# EAGLE design kemu10 (EAGLE 5.08)
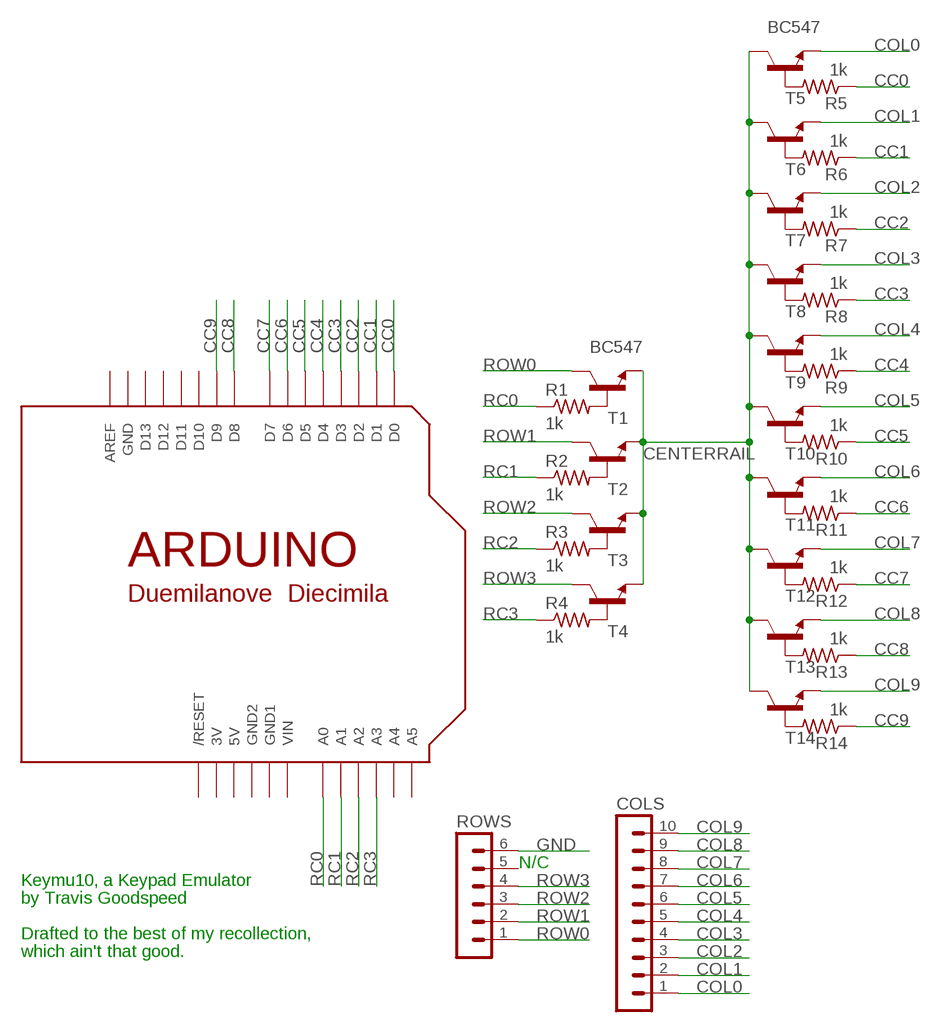
[diagram p0: schematic, sheet 1]

## Parts
COLS  MA10-1  [MA10-1]
R1  1k  FLIPFLOP-RES  [0805-THM]
R2  1k  FLIPFLOP-RES  [0805-THM]
R3  1k  FLIPFLOP-RES  [0805-THM]
R4  1k  FLIPFLOP-RES  [0805-THM]
R5  1k  FLIPFLOP-RES  [0805-THM]
R6  1k  FLIPFLOP-RES  [0805-THM]
R7  1k  FLIPFLOP-RES  [0805-THM]
R8  1k  FLIPFLOP-RES  [0805-THM]
R9  1k  FLIPFLOP-RES  [0805-THM]
R10  1k  FLIPFLOP-RES  [0805-THM]
R11  1k  FLIPFLOP-RES  [0805-THM]
R12  1k  FLIPFLOP-RES  [0805-THM]
R13  1k  FLIPFLOP-RES  [0805-THM]
R14  1k  FLIPFLOP-RES  [0805-THM]
ROWS  MA06-1  [MA06-1]
T1  BC547  [TO92]
T2  BC547  [TO92]
T3  BC547  [TO92]
T4  BC547  [TO92]
T5  BC547  [TO92]
T6  BC547  [TO92]
T7  BC547  [TO92]
T8  BC547  [TO92]
T9  BC547  [TO92]
T10  BC547  [TO92]
T11  BC547  [TO92]
T12  BC547  [TO92]
T13  BC547  [TO92]
T14  BC547  [TO92]
U$1  ARDUINODUEMILANOVE  [ARDUINO]

## Nets
CC0: R5.1 U$1.D0
CC1: R6.1 U$1.D1
CC2: R7.1 U$1.D2
CC3: R8.1 U$1.D3
CC4: R9.1 U$1.D4
CC5: R10.1 U$1.D5
CC6: R11.1 U$1.D6
CC7: R12.1 U$1.D7
CC8: R13.1 U$1.D8
CC9: R14.1 U$1.D9
CENTERRAIL: T1.1(E) T2.1(E) T3.1(E) T4.1(E) T5.3(C) T6.3(C) T7.3(C) T8.3(C) T9.3(C) T10.3(C) T11.3(C) T12.3(C) T13.3(C) T14.3(C)
COL0: COLS.1 T5.1(E)
COL1: COLS.2 T6.1(E)
COL2: COLS.3 T7.1(E)
COL3: COLS.4 T8.1(E)
COL4: COLS.5 T9.1(E)
COL5: COLS.6 T10.1(E)
COL6: COLS.7 T11.1(E)
COL7: COLS.8 T12.1(E)
COL8: COLS.9 T13.1(E)
COL9: COLS.10 T14.1(E)
GND: ROWS.6
N$1: R1.2 T1.2(B)
N$2: R2.2 T2.2(B)
N$3: R3.2 T3.2(B)
N$4: R4.2 T4.2(B)
N$6: R5.2 T5.2(B)
N$7: R6.2 T6.2(B)
N$8: R7.2 T7.2(B)
N$9: R8.2 T8.2(B)
N$10: R9.2 T9.2(B)
N$11: R10.2 T10.2(B)
N$12: R11.2 T11.2(B)
N$13: R12.2 T12.2(B)
N$14: R13.2 T13.2(B)
N$15: R14.2 T14.2(B)
RC0: R1.1 U$1.A0
RC1: R2.1 U$1.A1
RC2: R3.1 U$1.A2
RC3: R4.1 U$1.A3
ROW0: ROWS.1 T1.3(C)
ROW1: ROWS.2 T2.3(C)
ROW2: ROWS.3 T3.3(C)
ROW3: ROWS.4 T4.3(C)
Unconnected: ROWS.5 U$1.A4 U$1.A5 U$1.AREF U$1.D10 U$1.D11 U$1.D12 U$1.D13 U$1.RESET(/RESET)

## Notes on the sheet
- N/C
- Keymu10, a Keypad Emulator
- by Travis Goodspeed
- Drafted to the best of my recollection,
- which ain't that good.

## Power pins joined to a net without a drawn wire
3V: U$1.3V
5V: U$1.5V
GND: U$1.GND
GND1: U$1.GND1
GND2: U$1.GND2
VIN: U$1.VIN

## Library data of the parts
COLS = con-lstb:MA10-1: PIN HEADER
R1-R14 = adafruit:FLIPFLOP-RES: Flip Flop resistor An 0805 resistor inside a standard 1/4W 5% resistor. Makes for easy mods
ROWS = con-lstb:MA06-1: PIN HEADER
T1-T14 = transistor:BC547: NPN TRANSISTOR
U$1 = adafruit:ARDUINO: Arduino Diecimila/Duemilanove Make a shield with ease, this package has all the named pins as well as the two mounting drill holes and an outline of the USB and DC power connector. The outline is on the DIMENSION layer, so if your board house uses it they will cut the outline to match. http://www.ladyada.net/library/pcb/eaglelibrary.html

## Board
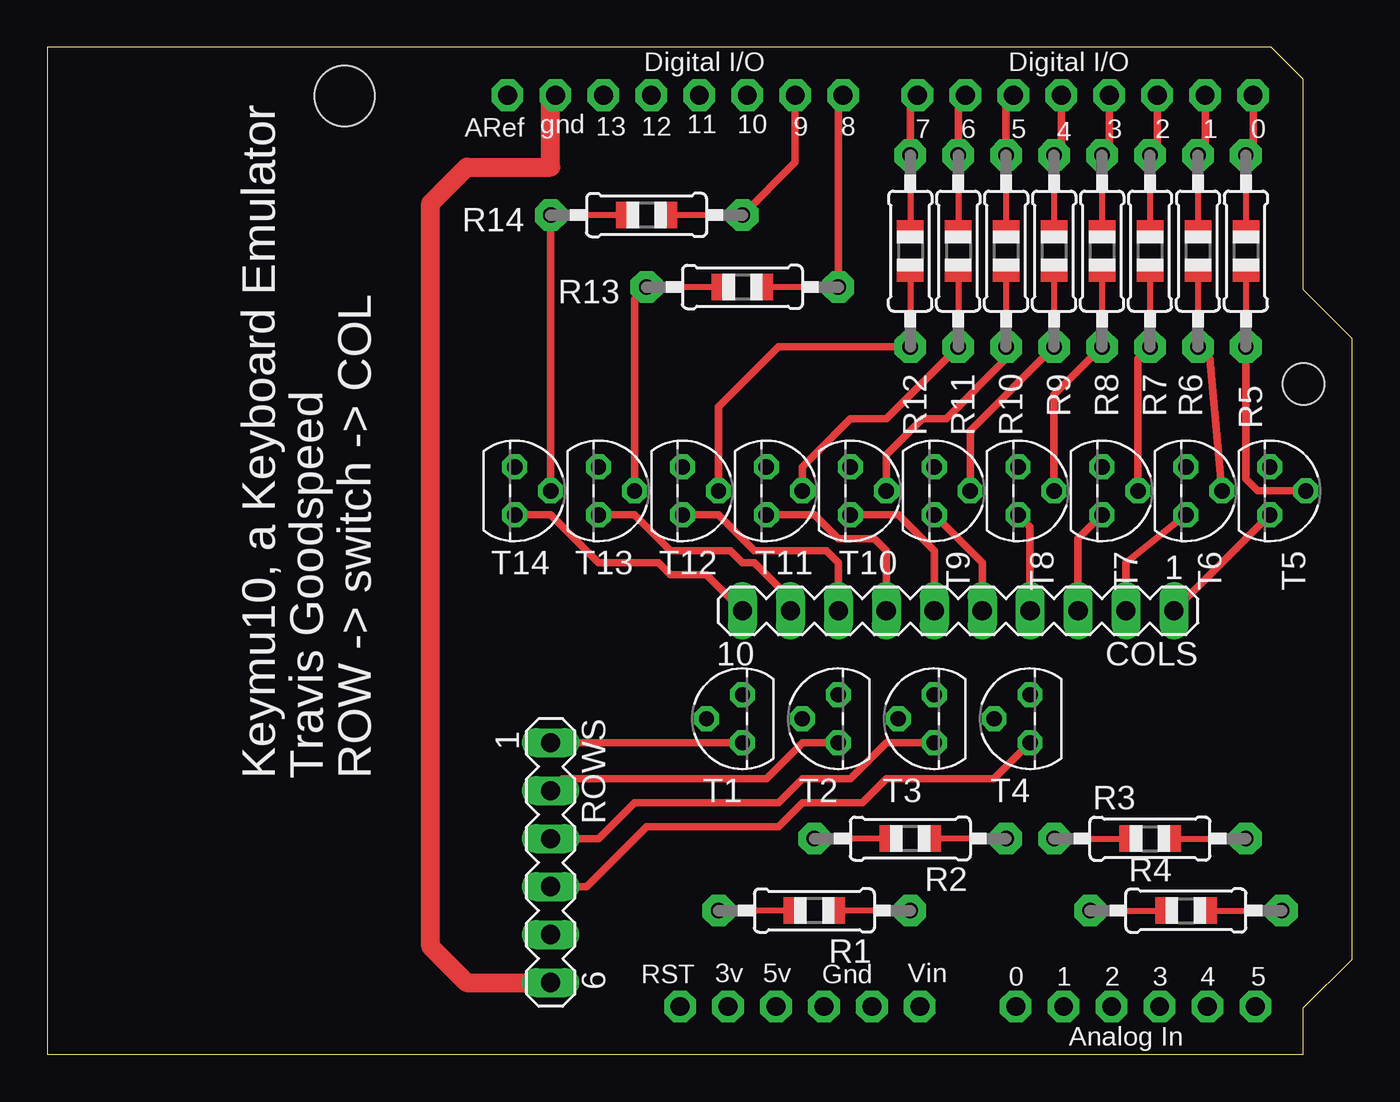
[diagram p1: board, top side]
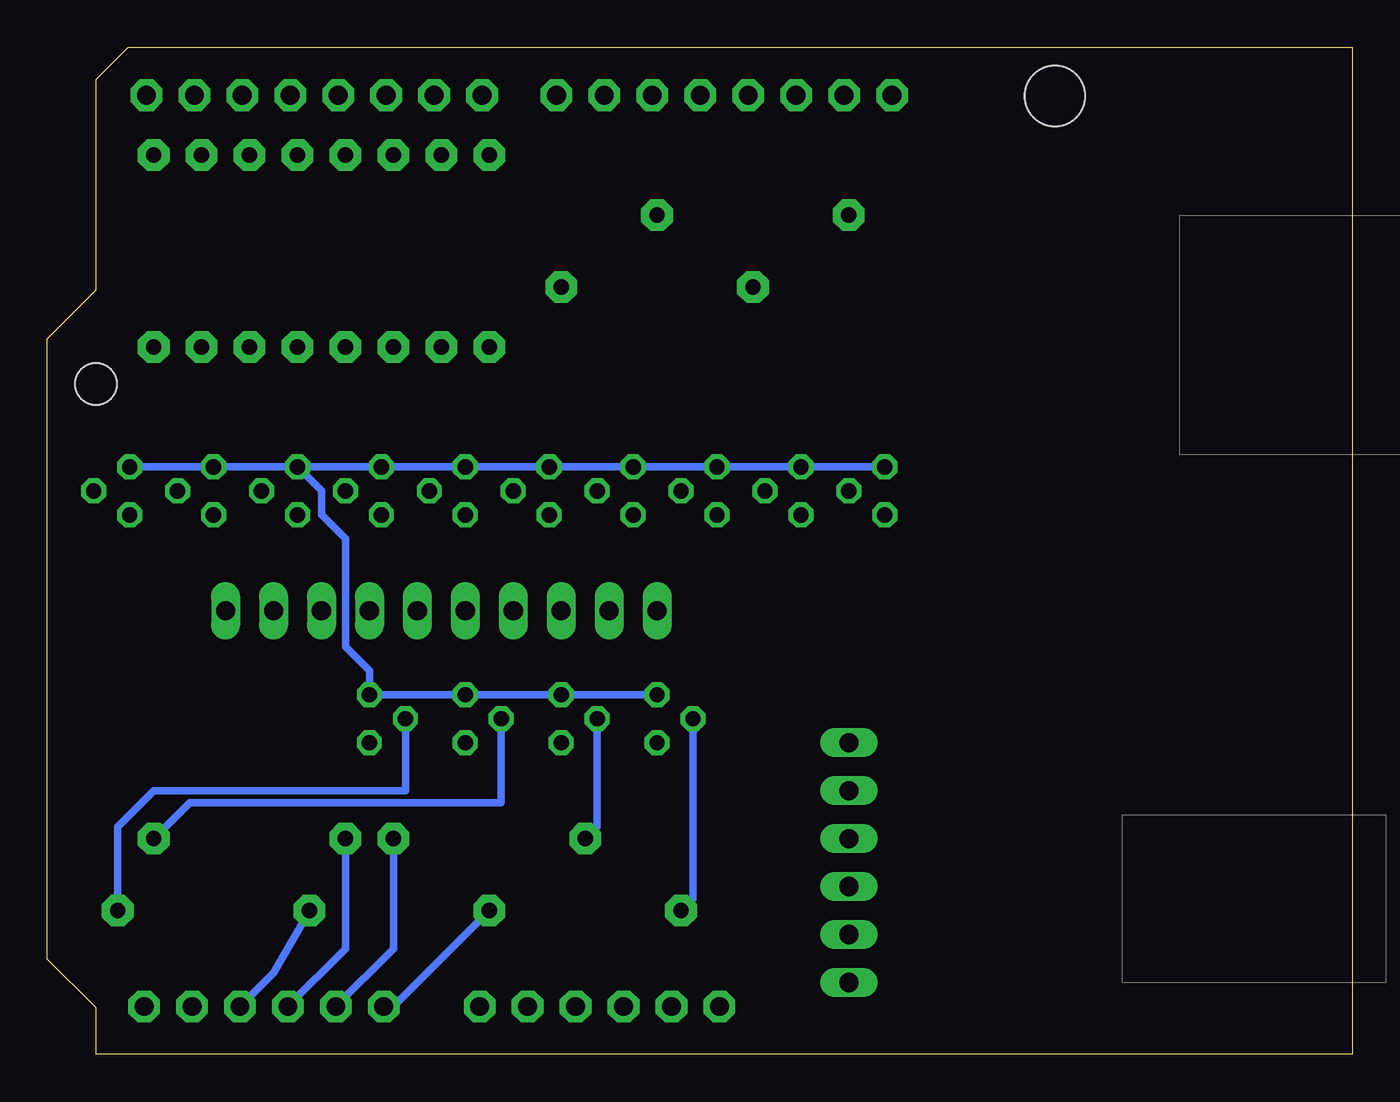
[diagram p2: board, bottom side, seen from below]

Size 69.14 x 53.34 mm. Coordinates in mm from the lower left corner, seen from the top.
Copper layers (1*16): Top 0.035mm / dielectric 1.5mm / Bottom 0.035mm
Design rules "default": minimum track width 10mil, minimum drill 24mil, track to track 8mil, track to pad 8mil, pad to pad 8mil, via to via 8mil, smd to smd 8mil, copper to edge 40mil, drill to drill 8mil, minimum pad ring 10mil, minimum via ring 8mil, stop-mask expansion 4mil, vias tented up to drill 0mil, thermal gap 10mil

### Footprints (pad centres in the part's own frame; a part is rotated, then mirrored left to right if it is on the bottom)
MA10-1 = drill 1.016 long: 1 -11.43,0; 2 -8.89,0; 3 -6.35,0; 4 -3.81,0; 5 -1.27,0; 6 1.27,0; 7 3.81,0; 8 6.35,0; 9 8.89,0; 10 11.43,0
0805-THM = drill 0.813 pad 1.676 octagon: 1 -5.08,0; 2 5.08,0
MA06-1 = drill 1.016 long: 1 -6.35,0; 2 -3.81,0; 3 -1.27,0; 4 1.27,0; 5 3.81,0; 6 6.35,0
TO92 = drill 0.813 octagon: 1 1.27,0; 2 0,1.905; 3 -1.27,0
ARDUINO = drill 1 pad 1.676 octagon: 3V 36.068,2.54; 5V 38.608,2.54; A0 51.308,2.54; A1 53.848,2.54; A2 56.388,2.54; A3 58.928,2.54; A4 61.468,2.54; A5 64.008,2.54; AREF 24.384,50.8; D0 63.881,50.8; D1 61.341,50.8; D2 58.801,50.8; D3 56.261,50.8; D4 53.721,50.8; D5 51.181,50.8; D6 48.641,50.8; D7 46.101,50.8; D8 42.164,50.8; D9 39.624,50.8; D10 37.084,50.8; D11 34.544,50.8; D12 32.004,50.8; D13 29.464,50.8; GND 26.924,50.8; GND1 43.688,2.54; GND2 41.148,2.54; RESET 33.528,2.54; VIN 46.228,2.54 | hole 3.2: 15.758,50.754 | hole 2.2: 66.558,35.514

### Placement (x,y rotation side)
COLS  48.26,23.5 180 top
R1  40.64,7.62 180 top
R2  45.72,11.43 180 top
R3  58.42,11.43 0 top
R4  60.33,7.62 0 top
R5  63.5,42.55 270 top
R6  60.96,42.55 270 top
R7  58.42,42.55 270 top
R8  55.88,42.55 270 top
R9  53.34,42.55 270 top
R10  50.8,42.55 270 top
R11  48.26,42.55 270 top
R12  45.72,42.55 270 top
R13  36.83,40.64 180 top
R14  31.75,44.45 180 top
ROWS  26.67,10.16 270 top
T1  36.83,17.78 90 top
T2  41.91,17.78 90 top
T3  46.99,17.78 90 top
T4  52.07,17.78 90 top
T5  64.77,29.84 270 top
T6  60.33,29.84 270 top
T7  55.88,29.84 270 top
T8  51.44,29.84 270 top
T9  46.99,29.84 270 top
T10  42.55,29.84 270 top
T11  38.1,29.84 270 top
T12  33.66,29.84 270 top
T13  29.21,29.84 270 top
T14  24.77,29.84 270 top
U$1  0,0 0 top

### Tracks (layer width: path | path; a pad name or v marks a point on that pad's centre or on a via)
CC0
  Top 0.406: U$1.D0 63.88,48.01 R5.1
CC1
  Top 0.406: U$1.D1 61.34,47.37 60.96,46.99 R6.1
CC2
  Top 0.406: U$1.D2 58.8,48.01 R7.1
CC3
  Top 0.406: U$1.D3 56.26,48.01 R8.1
CC4
  Top 0.406: U$1.D4 53.72,48.01 R9.1
CC5
  Top 0.406: R10.1 50.8,50.42 U$1.D5
CC6
  Top 0.406: R11.1 48.26,50.42 U$1.D6
CC7
  Top 0.406: R12.1 45.72,50.42 U$1.D7
CC8
  Top 0.406: R13.1 41.91,50.55 U$1.D8
CC9
  Top 0.406: U$1.D9 39.62,47.24 R14.1
CENTERRAIL
  Bottom 0.406: T1.1 T2.1 T3.1 T4.1 52.07,20.32 53.34,21.59 53.34,27.3 54.61,28.57 54.61,29.84 T7.3 | T14.3 T13.3 T12.3 T11.3 T10.3 T9.3 T8.3 T7.3 | T7.3 T6.3 T5.3
COL0
  Top 0.406: COLS.1 T5.1
COL1
  Top 0.406: COLS.2 57.15,26.04 T6.1
COL2
  Top 0.406: COLS.3 54.61,27.3 T7.1
COL3
  Top 0.406: COLS.4 52.07,27.94 T8.1
COL4
  Top 0.406: COLS.5 49.53,26.04 T9.1
COL5
  Top 0.406: T10.1 45.09,28.57 46.99,26.67 COLS.6
COL6
  Top 0.406: T11.1 40.64,28.57 41.91,27.3 43.81,27.3 44.45,26.67 COLS.7 44.45,22.86
COL7
  Top 0.406: T12.1 35.56,28.57 37.47,26.67 41.27,26.67 41.91,26.04 COLS.8 41.91,22.86
COL8
  Top 0.406: T13.1 31.11,28.57 33.02,26.67 36.2,26.67 36.83,26.04 37.47,26.04 39.37,24.13 COLS.9
COL9
  Top 0.406: T14.1 26.67,28.57 29.21,26.04 32.38,26.04 33.02,25.4 34.92,25.4 COLS.10
GND
  Top 1.016: ROWS.6 22.23,3.81 20.32,5.71 20.32,45.09 22.23,46.99 26.67,46.99 26.67,50.55 U$1.GND
N$1
  Bottom 0.406: R1.2 34.92,8.26 T1.2
N$2
  Bottom 0.406: R2.2 40.01,12.06 T2.2
N$3
  Bottom 0.406: R3.2 61.59,13.34 45.09,13.34 T3.2
N$4
  Bottom 0.406: R4.2 65.41,12.06 63.5,13.97 50.16,13.97 T4.2
N$6
  Top 0.406: 63.5,35.56 R5.2 63.5,30.48 64.14,29.84 T5.2
N$7
  Top 0.406: T6.2 61.59,36.83 R6.2
N$8
  Top 0.406: T7.2 57.78,36.83 R7.2
N$9
  Top 0.406: T8.2 53.34,34.92 R8.2
N$10
  Top 0.406: T9.2 48.9,33.02 R9.2
N$11
  Top 0.406: R10.2 50.8,36.83 47.62,33.66 46.35,33.66 44.45,31.75 T10.2
N$12
  Top 0.406: T11.2 40.01,31.11 42.55,33.66 44.45,33.66 R11.2
N$13
  Top 0.406: T12.2 35.56,34.29 38.73,37.47 R12.2
N$14
  Top 0.406: T13.2 31.11,40.01 R13.2
N$15
  Top 0.406: T14.2 R14.2
RC0
  Bottom 0.406: U$1.A0 50.8,2.54 R1.1
RC1
  Bottom 0.406: U$1.A1 50.8,5.59 R2.1
RC2
  Bottom 0.406: U$1.A2 53.34,5.59 R3.1
RC3
  Bottom 0.406: U$1.A3 57.15,4.32 R4.1
ROW0
  Top 0.406: ROWS.1 T1.3
ROW1
  Top 0.406: T2.3 40.01,16.51 38.1,14.61 27.3,14.61 ROWS.2
ROW2
  Top 0.406: T3.3 44.45,16.51 42.55,14.61 40.01,14.61 38.73,13.34 31.11,13.34 29.21,11.43 ROWS.3
ROW3
  Top 0.406: ROWS.4 28.57,8.89 31.75,12.06 38.73,12.06 40.01,13.34 43.18,13.34 44.45,14.61 50.16,14.61 T4.3

### Text on the board
tNames: Keymu10, a Keyboard Emulator | Travis Goodspeed | ROW -> switch -> COL